# EAGLE design Ammeter (EAGLE 7.2.0)
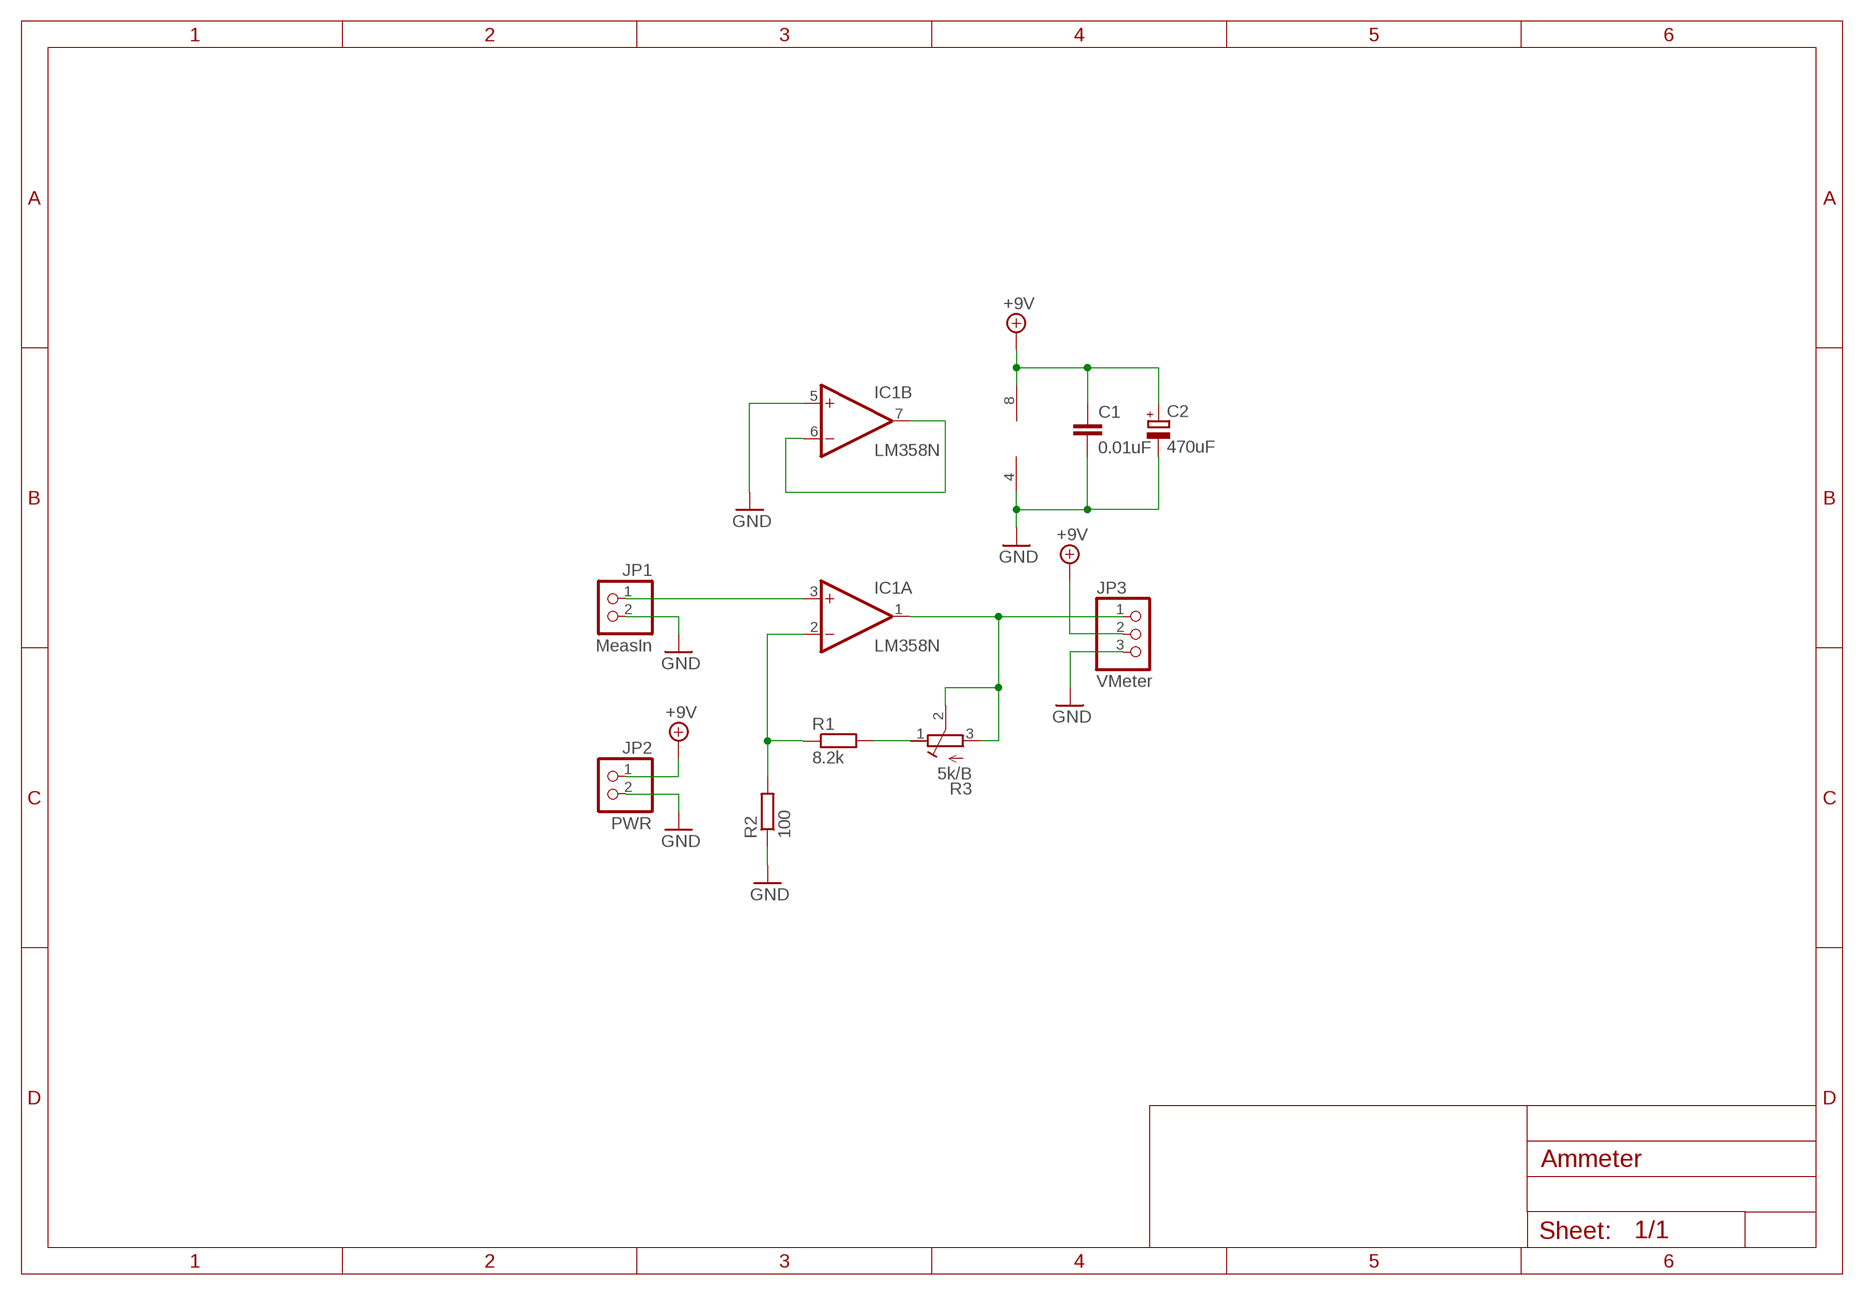
[diagram p0: schematic, sheet 1]

## Parts
C1  0.01uF  C-EU025-024X044  [C025-024X044]
C2  470uF  CPOL-EUSANYO_F13  [SANYO-OSCON_F13]
IC1  LM358N  [DIL08]
JP1  MeasIn  PINHD-1X2  [1X02]
JP2  PWR  PINHD-1X2  [1X02]
JP3  VMeter  PINHD-1X3  [1X03]
R1  8.2k  R-EU_0207/7  [0207/7]
R2  100  R-EU_0207/7  [0207/7]
R3  5k/B  R-TRIMM43P  [RTRIM43P]

## Nets
+9V: C1.1 C2.+ IC1.8(P:V+) JP2.1 JP3.2
GND: C1.2 C2.- IC1.4(P:V-) IC1.5(B:+IN) JP1.2 JP2.2 JP3.3 R2.1
N$1: IC1.3(A:+IN) JP1.1
N$4: IC1.2(A:-IN) R1.1 R2.2
N$5: IC1.1(A:OUT) JP3.1 R3.2(S) R3.3(A)
N$6: R1.2 R3.1(E)
N$9: IC1.6(B:-IN) IC1.7(B:OUT)

## Library data of the parts
C1 = rcl:C-EU: CAPACITOR, European symbol
C2 = rcl:CPOL-EU: POLARIZED CAPACITOR, European symbol
IC1 = linear:LM358: OP AMP also LM158; LM258; LM2904 Source: http://cache.national.com/ds/LM/LM158.pdf
JP1 JP2 = pinhead:PINHD-1X2: PIN HEADER
JP3 = pinhead:PINHD-1X3: PIN HEADER
R1 R2 = rcl:R-EU_: RESISTOR, European symbol
R3 = rcl:R-TRIMM: Trimm resistor

## Board
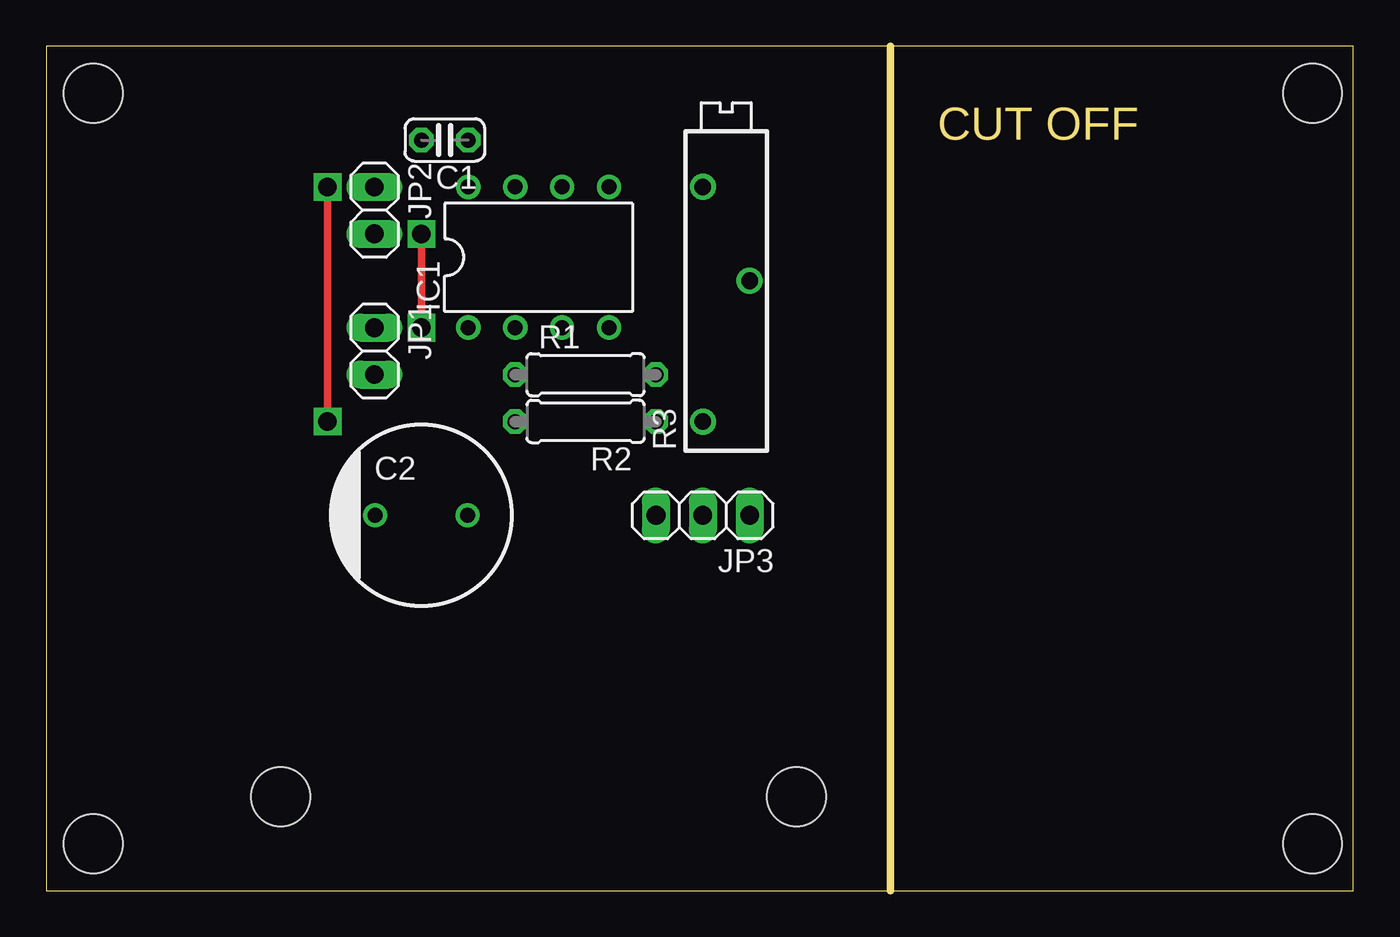
[diagram p1: board, top side]
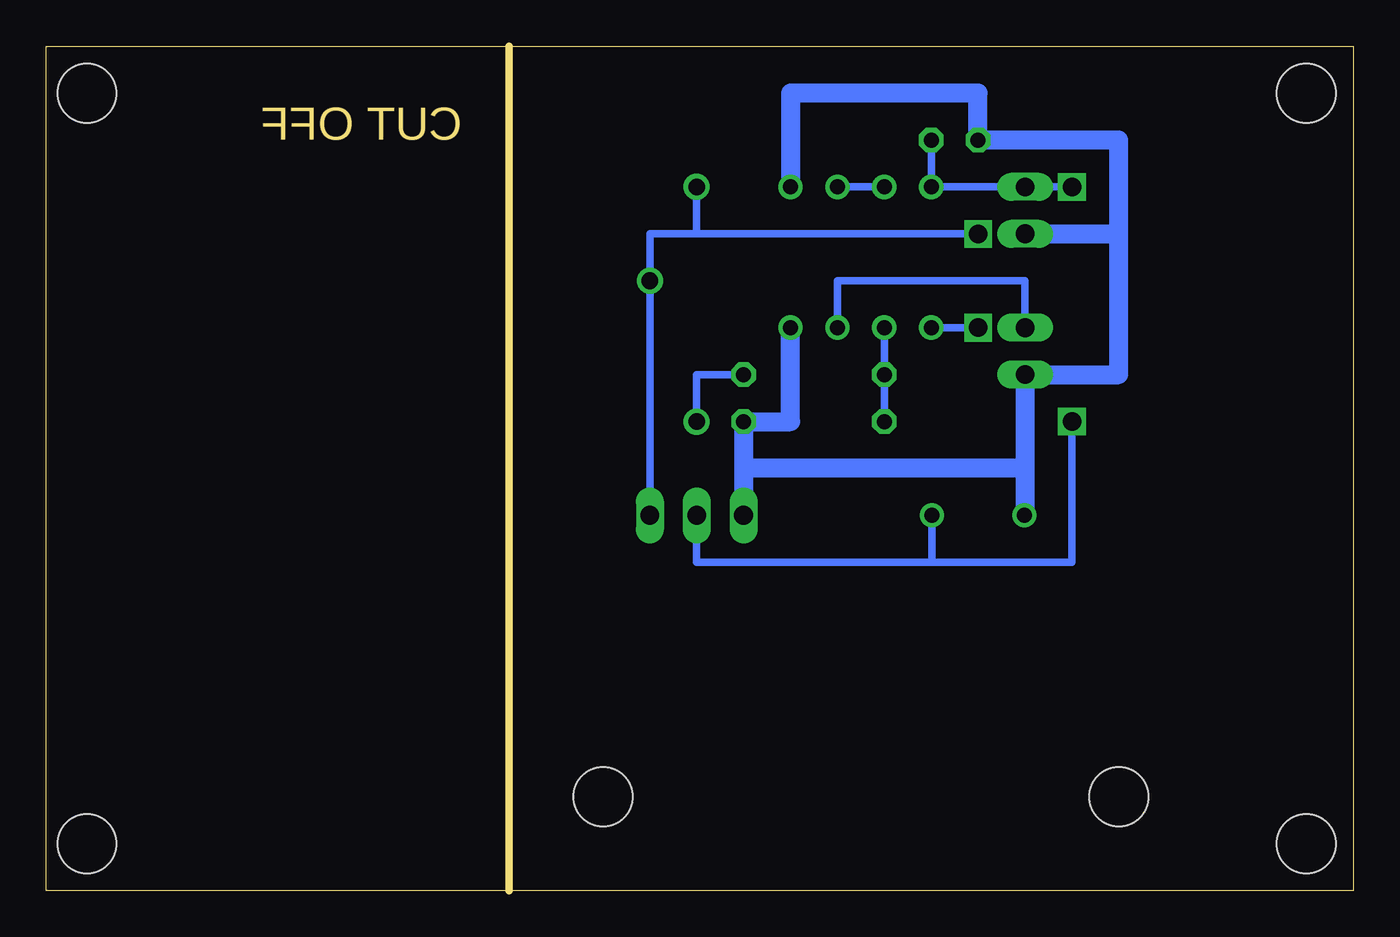
[diagram p2: board, bottom side, seen from below]

Size 70.79 x 45.72 mm. Coordinates in mm from the lower left corner, seen from the top.
Outline: 45.72,0 0,0 0,45.71 70.79,45.71 70.79,0 45.72,0
Outline: 45.72,0 45.72,45.72
Copper layers (1*16): Top 0.035mm / dielectric 1.5mm / Bottom 0.035mm
Design rules "default": minimum track width 10mil, minimum drill 24mil, track to track 8mil, track to pad 8mil, pad to pad 8mil, via to via 8mil, smd to smd 8mil, copper to edge 40mil, drill to drill 8mil, minimum pad ring 10mil, minimum via ring 8mil, stop-mask expansion 4mil, vias tented up to drill 0mil, thermal gap 10mil
Holes 3.2 mm at 2.54,43.18 2.54,2.54 68.58,2.54 68.58,43.18 12.7,5.08 40.64,5.08
tKeepout: area 15.2,-2.5 to 38.1,12.7

### Footprints (pad centres in the part's own frame; a part is rotated, then mirrored left to right if it is on the bottom)
C025-024X044 = drill 0.813 octagon: 1 -1.27,0; 2 1.27,0
SANYO-OSCON_F13 = drill 0.8 pad 1.27: + 2.5,0; - -2.5,0
DIL08 = drill 0.813 pad 1.27: 1 -3.81,-3.81; 2 -1.27,-3.81; 3 1.27,-3.81; 4 3.81,-3.81; 5 3.81,3.81; 6 1.27,3.81; 7 -1.27,3.81; 8 -3.81,3.81
1X02 = drill 1.016 long: 1 -1.27,0; 2 1.27,0
1X03 = drill 1.016 long: 1 -2.54,0; 2 0,0; 3 2.54,0
0207/7 = drill 0.813 octagon: 1 -3.81,0; 2 3.81,0
RTRIM43P = drill 0.9: 1 -7.62,1.27; 2 0,-1.27; 3 5.08,1.27

### Placement (x,y rotation side)
C1  21.59,40.64 180 top
C2  20.32,20.32 0 top
IC1  26.67,34.29 0 top
JP1  17.78,29.21 270 top
JP2  17.78,36.83 270 top
JP3  35.56,20.32 180 top
R1  29.21,27.94 0 top
R2  29.21,25.4 180 top
R3  36.83,33.02 90 top

### Tracks (layer width: path | path; a pad name or v marks a point on that pad's centre or on a via)
+9V  (via drill 1)
  Top 0.406: v15.24,25.4 v15.24,38.1
  Bottom 0.406: C1.1 IC1.8 JP2.1 v15.24,38.1 | v15.24,25.4 15.24,17.78 22.86,17.78 | 22.86,17.78 35.56,17.78 JP3.2 | C2.+ 22.82,17.82 22.86,17.78
GND
  Bottom 1.016: JP2.2 12.7,35.56 | 12.7,35.56 12.7,40.64 C1.2 20.32,43.18 30.48,43.18 IC1.5 | 12.7,35.56 12.7,27.94 JP1.2 17.78,22.86 | IC1.4 30.48,25.4 R2.1 33.02,22.86 | 33.02,22.86 JP3.3 | 17.82,20.36 C2.- 17.78,20.36 17.78,22.86 | 17.78,22.86 33.02,22.86
N$1
  Bottom 0.406: IC1.3 27.94,33.02 17.78,33.02 JP1.1
N$4
  Bottom 0.406: IC1.2 R1.1 R2.2
N$5  (via drill 1)
  Top 0.406: v20.32,35.56 v20.32,30.48
  Bottom 0.406: R3.3 35.56,35.56 | 35.56,35.56 v20.32,35.56 | v20.32,30.48 IC1.1 | JP3.1 R3.2 38.1,35.56 35.56,35.56
N$6
  Bottom 0.406: R1.2 35.56,27.94 R3.1
N$9
  Bottom 0.406: IC1.7 IC1.6

### Text on the board
Dimension: CUT OFF